# Altium schematic sheet control.SchDoc
size A4
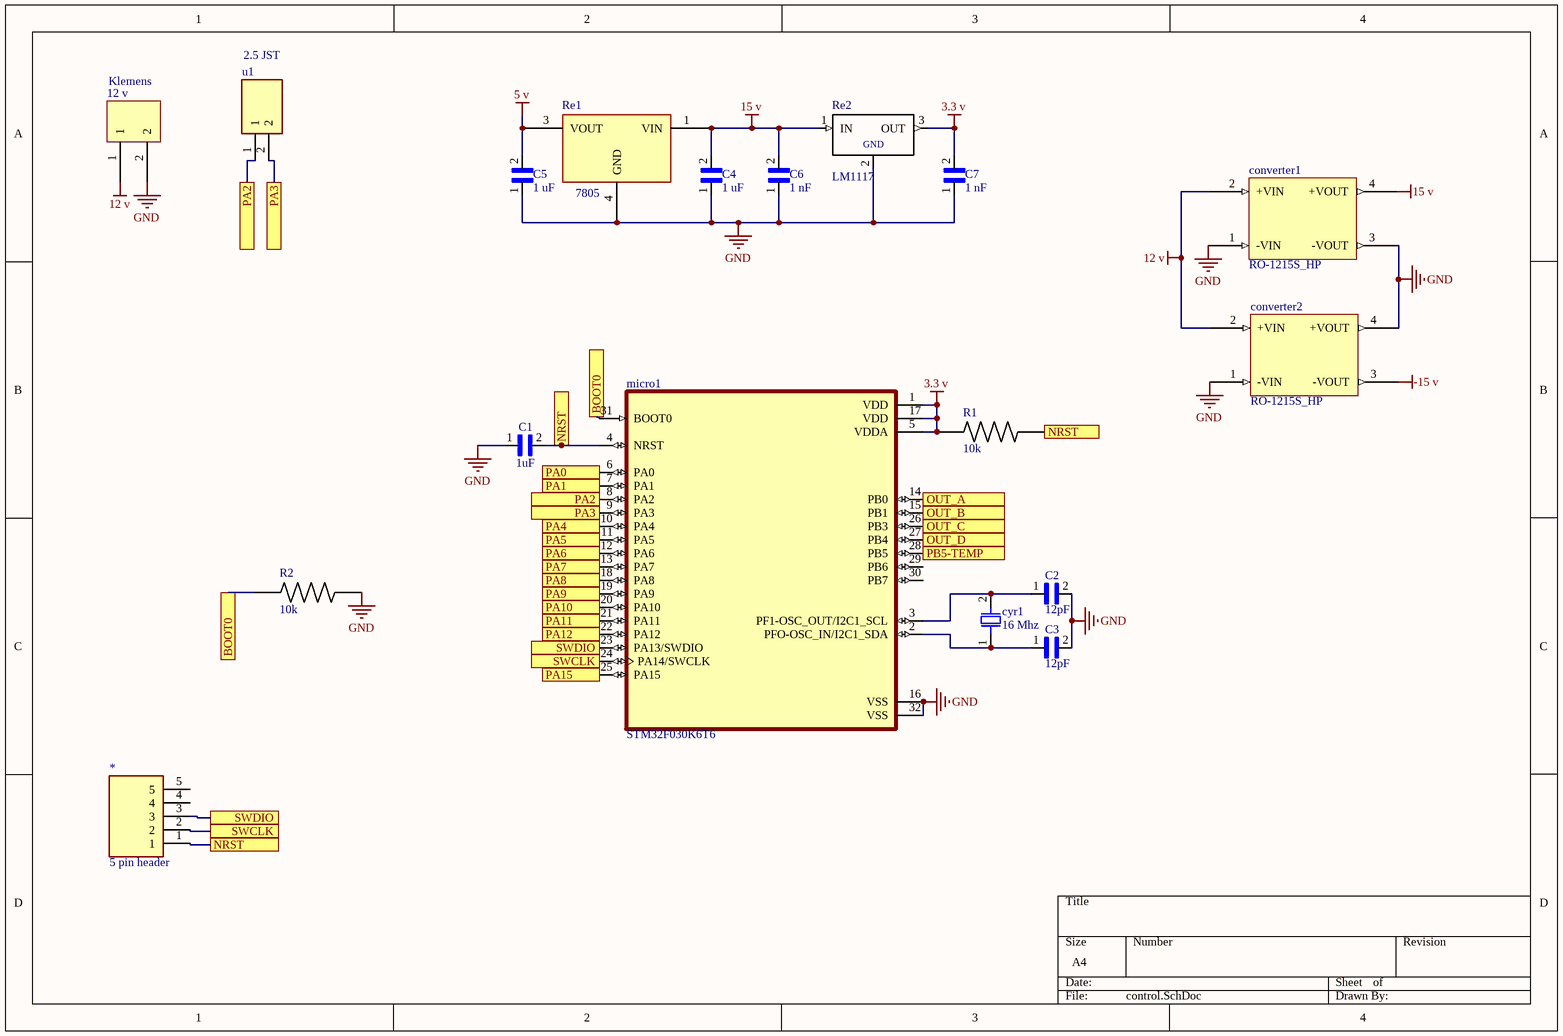
[diagram p0: control.SchDoc]

## Parts
12_v  Klemens  [Klemens]
*  5 pin header  [5 pin header]
C1  1uF  [12pF capacitor]
C2  12pF  [12pF capacitor]
C3  12pF  [12pF capacitor]
C4  1 uF  [1nF]
C5  1 uF  [1nF]
C6  1 nF  [1nF]
C7  1 nF  [1nF]
converter1  RO-1215S_HP  [RO-1215S_HP]
converter2  RO-1215S_HP  [RO-1215S_HP]
cyr1  16 Mhz  [16 Mhz cyrstal]
micro1  STM32F030K6T6  [STM32F030K6T6]
R1  10k  [Reisitor]
R2  10k  [Reisitor]
Re1  7805  [7805]
Re2  LM1117  [LM1117]
u1  2.5 JST  [2.5 JST]

## Ports
BOOT0, NRST, OUT_A, OUT_B, OUT_C, OUT_D, PA0, PA1, PA2, PA3, PA4, PA5, PA6, PA7, PA8, PA9, PA10, PA11, PA12, PA15, PB5-TEMP, SWCLK, SWDIO

## Nets
3.3 v: C7.2 micro1.1(VDD) micro1.5(VDDA) micro1.17(VDD) R1.1 Re2.3(OUT)
5 v: C5.2 Re1.3(VOUT)
12 v: 12_v.1 converter1.2(+VIN) converter2.2(+VIN)
15 v: C4.2 C6.2 converter1.4(+VOUT) Re1.1(VIN) Re2.1(IN)
-15 v: converter2.3(-VOUT)
GND: 12_v.2 C1.1 C2.2 C3.2 C4.1 C5.1 C6.1 C7.1 converter1.1(-VIN) converter1.3(-VOUT) converter2.1(-VIN) converter2.4(+VOUT) micro1.16(VSS) micro1.32(VSS) R2.2 Re1.4(GND) Re2.2(GND)
BOOT0: micro1.31(BOOT0) R2.1 ; port BOOT0
NRST: *.1 C1.2 micro1.4(NRST) R1.2 ; port NRST
OUT_A: micro1.14(PB0) ; port OUT_A
OUT_B: micro1.15(PB1) ; port OUT_B
OUT_C: micro1.26(PB3) ; port OUT_C
OUT_D: micro1.27(PB4) ; port OUT_D
PA0: micro1.6(PA0) ; port PA0
PA1: micro1.7(PA1) ; port PA1
PA2: micro1.8(PA2) u1.1 ; port PA2
PA3: micro1.9(PA3) u1.2 ; port PA3
PA4: micro1.10(PA4) ; port PA4
PA5: micro1.11(PA5) ; port PA5
PA6: micro1.12(PA6) ; port PA6
PA7: micro1.13(PA7) ; port PA7
PA8: micro1.18(PA8) ; port PA8
PA9: micro1.19(PA9) ; port PA9
PA10: micro1.20(PA10) ; port PA10
PA11: micro1.21(PA11) ; port PA11
PA12: micro1.22(PA12) ; port PA12
PA15: micro1.25(PA15) ; port PA15
PB5-TEMP: micro1.28(PB5) ; port PB5-TEMP
SWCLK: *.2 micro1.24(PA14/SWCLK) ; port SWCLK
SWDIO: *.3 micro1.23(PA13/SWDIO) ; port SWDIO
NetC2_1: C2.1 cyr1.2 micro1.3(PF1-OSC_OUT/I2C1_SCL)
NetC3_1: C3.1 cyr1.1 micro1.2(PFO-OSC_IN/I2C1_SDA)

Not connected (* = marked no-connect by the designer): * 4 5; micro1 29(PB6) 30(PB7)

## Library data of the parts
C1-C3 = 12pF capacitor
C4 C5 = 1 nF
cyr1 = 16 Mhz cyrstal
R1 R2 = resitor